# Altium schematic sheet Output_CONN.SchDoc
size A4; SheetNumber: 8; SheetTotal: 8
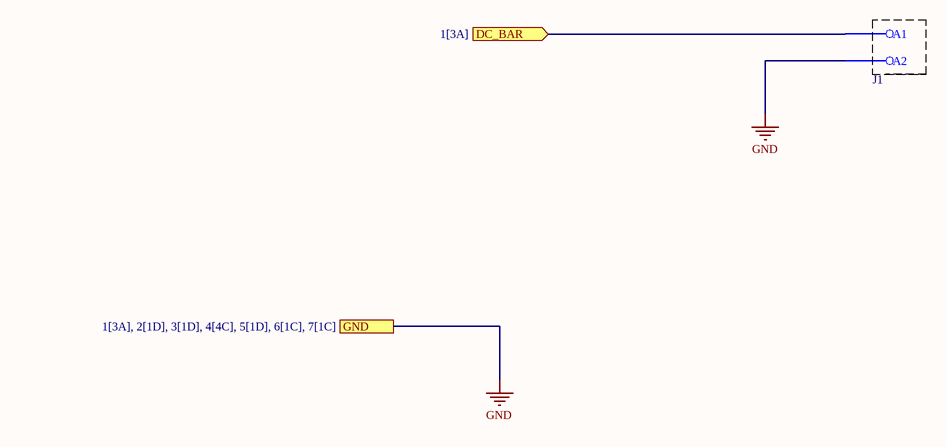
[diagram p0: Output_CONN.SchDoc]

## Parts
J1  DG136HT-10.16-02P-14-00A  [DG136HT-02P]  (value not drawn)

## Ports
DC_BAR (in, see 1[3A]), GND (see 1[3A], 2[1D], 3[1D], 4[4C], 5[1D], 6[1C], 7[1C])

## Nets
GND: J1.2(A2) ; port GND
DC_BAR: J1.1(A1) ; port DC_BAR

## Library data of the parts
J1 = DG136HT-10.16-02P-14-00A: PCB terminal blocks,Rated current: 65A,Rated voltage （III/2）1000V,Cross section:2.5-16mm²,pitch:10.16mm,connector method:Screw connector with tension sleeve,Color:green,Contact surface :Tin